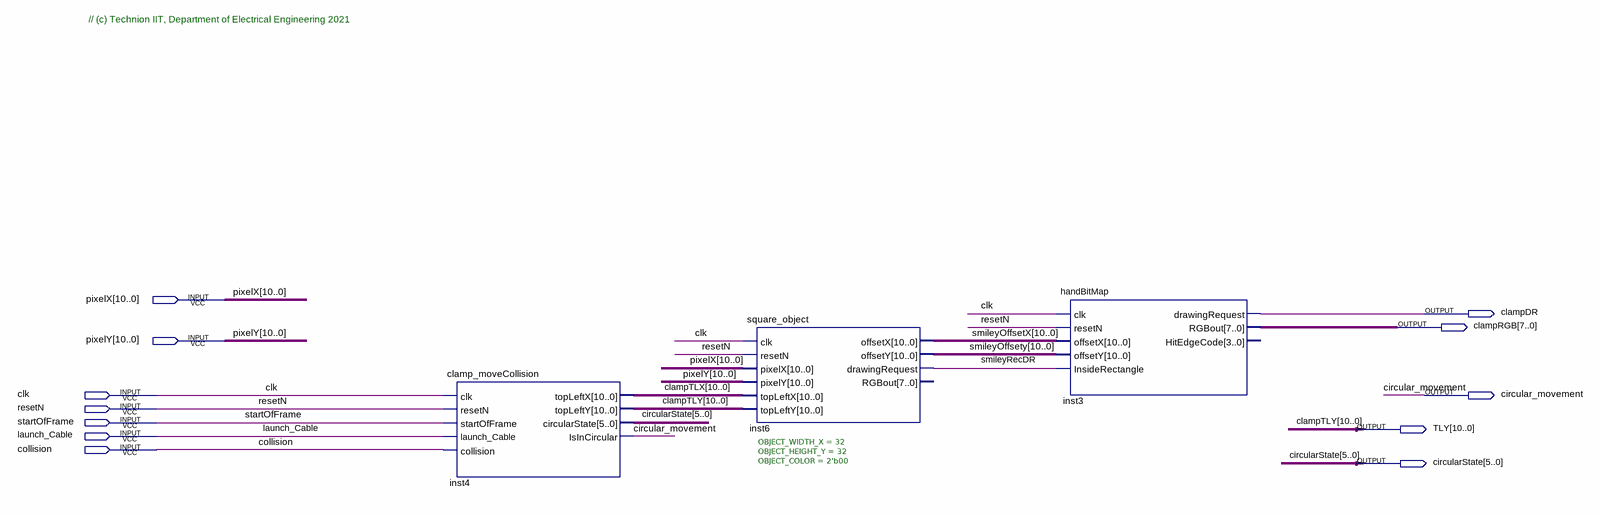
[diagram p0: schematic sheet]
// Quartus schematic Clamp_Block.bdf as structural Verilog: 3 symbols, 12 pins
module Clamp_Block (
  input  [10:0] pixelX,
  input  [10:0] pixelY,
  input  clk,
  input  resetN,
  input  startOfFrame,
  input  launch_Cable,
  input  collision,
  output clampDR,
  output [7:0] clampRGB,
  output circular_movement,
  output [10:0] TLY,
  output [5:0] circularState
);

  wire smileyRecDR;
  wire [10:0] clampTLX, smileyOffsetX, smileyOffsety;

  clamp_moveCollision inst4 (
    .clk(clk), .resetN(resetN), .startOfFrame(startOfFrame), .launch_Cable(launch_Cable),
    .collision(collision), .topLeftX(clampTLX), .topLeftY(TLY), .circularState(circularState),
    .IsInCircular(circular_movement));
  square_object #(.OBJECT_WIDTH_X(32), .OBJECT_HEIGHT_Y(32), .OBJECT_COLOR(2'b00)) inst6 (
    .clk(clk), .resetN(resetN), .pixelX(pixelX), .pixelY(pixelY), .topLeftX(clampTLX), .topLeftY(TLY),
    .offsetX(smileyOffsetX), .offsetY(smileyOffsety), .drawingRequest(smileyRecDR));  // open: RGBout
  handBitMap inst3 (
    .clk(clk), .resetN(resetN), .offsetX(smileyOffsetX), .offsetY(smileyOffsety),
    .InsideRectangle(smileyRecDR), .drawingRequest(clampDR), .RGBout(clampRGB));  // open: HitEdgeCode

  // Other names for the same wires on the sheet: clampTLY[10:0] = TLY

  // Notes on the sheet:
  //   // (c) Technion IIT, Department of Electrical Engineering 2021
endmodule
